# EAGLE design monitoring_1 (EAGLE 9.6.2)
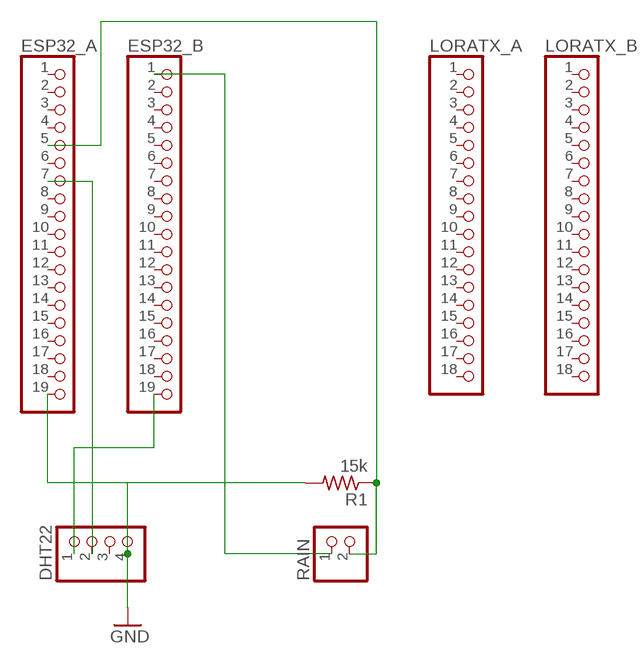
[diagram p0: schematic, sheet 1]

## Parts
DHT22  PINHD-1X4  [1X04]
ESP32_A  PINHD-1X19  [1X19]
ESP32_B  PINHD-1X19  [1X19]
LORATX_A  PINHD-1X18  [1X18]
LORATX_B  PINHD-1X18  [1X18]
R1  15k  R-US_0204/7  [0204/7]
RAIN  PINHD-1X2  [1X02]

## Nets
GND: DHT22.4 ESP32_A.19 R1.2
N$1: ESP32_A.5 R1.1 RAIN.2
N$2: DHT22.2 ESP32_A.7
N$3: DHT22.1 ESP32_B.19
N$4: ESP32_B.1 RAIN.1
Unconnected: DHT22.3 ESP32_A.1 ESP32_A.2 ESP32_A.3 ESP32_A.4 ESP32_A.6 ESP32_A.8 ESP32_A.9 ESP32_A.10 ESP32_A.11 ESP32_A.12 ESP32_A.13 ESP32_A.14 ESP32_A.15 ESP32_A.16 ESP32_A.17 ESP32_A.18 ESP32_B.2 ESP32_B.3 ESP32_B.4 ESP32_B.5 ESP32_B.6 ESP32_B.7 ESP32_B.8 ESP32_B.9 ESP32_B.10 ESP32_B.11 ESP32_B.12 ESP32_B.13 ESP32_B.14 ESP32_B.15 ESP32_B.16 ESP32_B.17 ESP32_B.18 LORATX_A.1 LORATX_A.2 LORATX_A.3 LORATX_A.4 LORATX_A.5 LORATX_A.6 LORATX_A.7 LORATX_A.8 LORATX_A.9 LORATX_A.10 LORATX_A.11 LORATX_A.12 LORATX_A.13 LORATX_A.14 LORATX_A.15 LORATX_A.16 LORATX_A.17 LORATX_A.18 LORATX_B.1 LORATX_B.2 LORATX_B.3 LORATX_B.4 LORATX_B.5 LORATX_B.6 LORATX_B.7 LORATX_B.8 LORATX_B.9 LORATX_B.10 LORATX_B.11 LORATX_B.12 LORATX_B.13 LORATX_B.14 LORATX_B.15 LORATX_B.16 LORATX_B.17 LORATX_B.18

## Library data of the parts
DHT22 = pinhead:PINHD-1X4: PIN HEADER
ESP32_A ESP32_B = pinhead:PINHD-1X19: PIN HEADER
LORATX_A LORATX_B = pinhead:PINHD-1X18: PIN HEADER
R1 = rcl:R-US_: RESISTOR, American symbol; SPICEPREFIX: R
RAIN = pinhead:PINHD-1X2: PIN HEADER

## Board
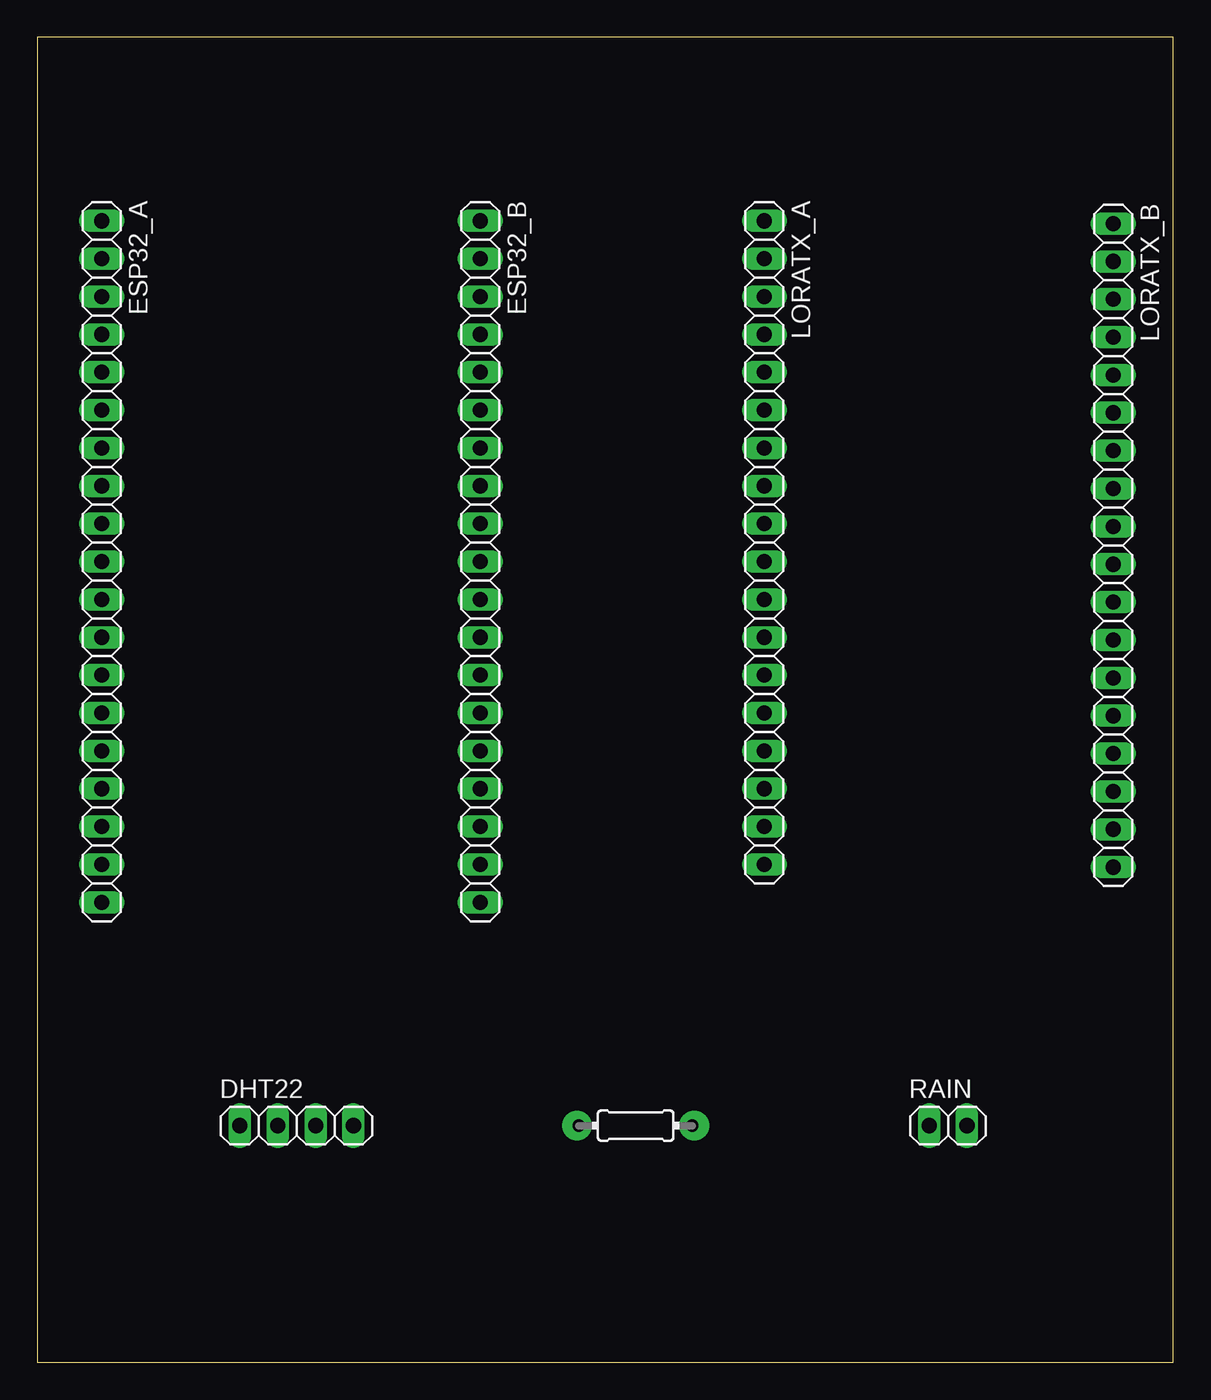
[diagram p1: board, top side]
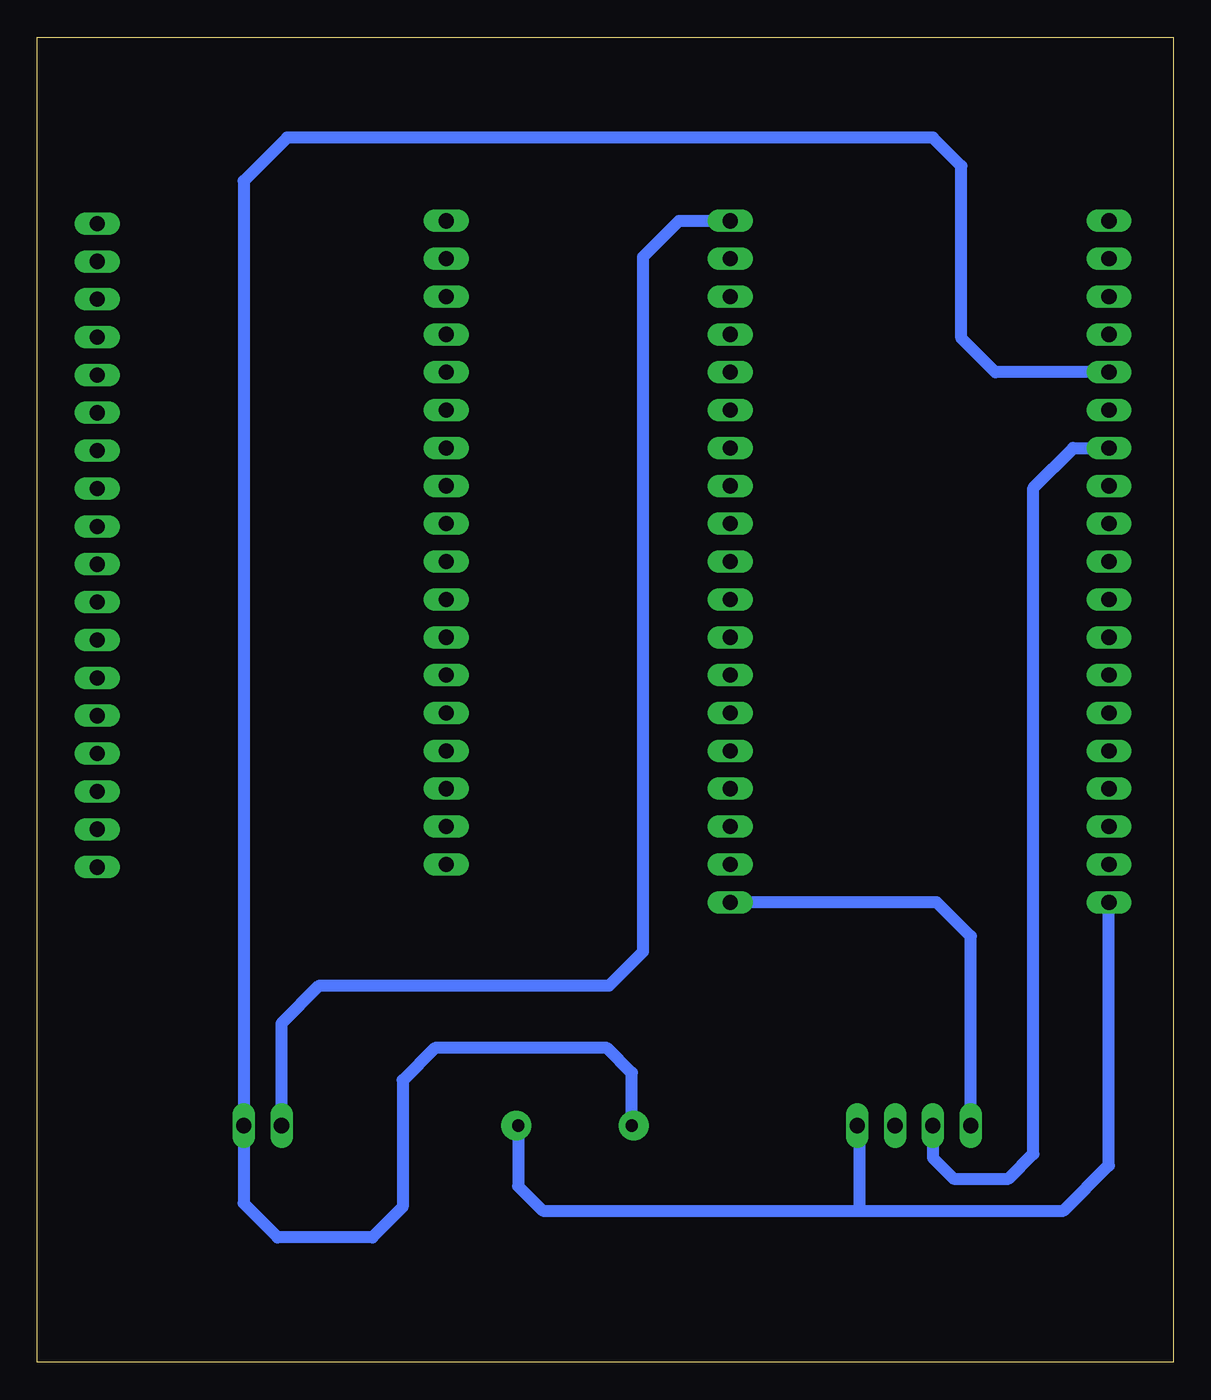
[diagram p2: board, bottom side, seen from below]

Size 76.2 x 88.9 mm. Coordinates in mm from the lower left corner, seen from the top.
Outline: 0,0 76.2,0 76.2,88.9 0,88.9 0,0
Copper layers (1*16): Top 0.035mm / dielectric 1.5mm / Bottom 0.035mm
Design rules "default": minimum track width 6mil, minimum drill 0.35mm, track to track 6mil, track to pad 6mil, pad to pad 6mil, via to via 6mil, smd to smd 6mil, copper to edge 40mil, drill to drill 6mil, minimum pad ring 10mil, minimum via ring 8mil, stop-mask expansion 4mil, vias tented up to drill 0mil, thermal gap 10mil

### Footprints (pad centres in the part's own frame; a part is rotated, then mirrored left to right if it is on the bottom)
1X04 = drill 1.016 long: 1 -3.81,0; 2 -1.27,0; 3 1.27,0; 4 3.81,0
1X19 = drill 1.016 long: 1 -22.86,0; 2 -20.32,0; 3 -17.78,0; 4 -15.24,0; 5 -12.7,0; 6 -10.16,0; 7 -7.62,0; 8 -5.08,0; 9 -2.54,0; 10 0,0; 11 2.54,0; 12 5.08,0; 13 7.62,0; 14 10.16,0; 15 12.7,0; 16 15.24,0; 17 17.78,0; 18 20.32,0; 19 22.86,0
1X18 = drill 1.016 long: 1 -21.59,0; 2 -19.05,0; 3 -16.51,0; 4 -13.97,0; 5 -11.43,0; 6 -8.89,0; 7 -6.35,0; 8 -3.81,0; 9 -1.27,0; 10 1.27,0; 11 3.81,0; 12 6.35,0; 13 8.89,0; 14 11.43,0; 15 13.97,0; 16 16.51,0; 17 19.05,0; 18 21.59,0
0204/7 = drill 0.813 octagon: 1 -3.81,0; 2 3.81,0
1X02 = drill 1.016 long: 1 -1.27,0; 2 1.27,0

### Placement (x,y rotation side)
DHT22  17.4,15.88 0 top
ESP32_A  4.32,53.72 270 top
ESP32_B  29.72,53.72 270 top
LORATX_A  48.77,54.99 270 top
LORATX_B  72.17,54.81 270 top
R1  40.13,15.88 0 top
RAIN  61.09,15.88 0 top

### Tracks (layer width: path | path; a pad name or v marks a point on that pad's centre or on a via)
GND
  Bottom 0.813: R1.2 43.94,11.81 42.29,10.16 21.08,10.16 | ESP32_A.19 4.32,13.21 7.37,10.16 21.08,10.16 | DHT22.4 21.08,15.75 21.08,10.16
N$1
  Bottom 0.813: ESP32_A.5 11.94,66.42 14.22,68.71 14.22,80.26 16.13,82.17 59.44,82.17 62.36,79.25 RAIN.2 62.36,10.67 60.07,8.38 53.72,8.38 51.69,10.41 51.69,18.92 49.53,21.08 37.97,21.08 36.32,19.43 R1.1
N$2
  Bottom 0.813: DHT22.2 16.13,13.72 14.73,12.32 11.05,12.32 9.4,13.97 9.4,58.67 6.73,61.34 ESP32_A.7
N$3
  Bottom 0.813: DHT22.1 13.59,28.57 15.88,30.86 ESP32_B.19
N$4
  Bottom 0.813: RAIN.1 59.82,22.73 57.28,25.27 37.85,25.27 35.56,27.56 35.56,74.17 33.15,76.58 ESP32_B.1
N$5  (via drill 0.35 pad 2)
  other vias: 36.2,15.88
N$6  (via drill 0.35 pad 2)
  other vias: 44.07,15.88